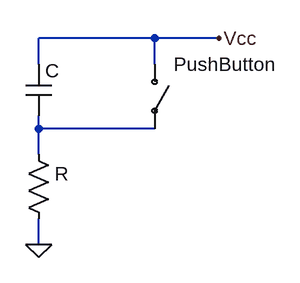
[diagram p0: schematic push_btn_debouncing.asc]
push_btn_debouncing.asc, the LTspice schematic file:
Version 4
SHEET 1 880 680
WIRE 176 48 32 48
WIRE 256 48 176 48
WIRE 32 80 32 48
WIRE 176 80 176 48
WIRE 32 160 32 144
WIRE 176 160 32 160
WIRE 32 192 32 160
WIRE 32 304 32 272
FLAG 32 304 0
FLAG 256 48 Vcc
SYMBOL cap 16 80 R0
SYMATTR InstName C
SYMATTR Value ""
SYMBOL res 16 176 R0
SYMATTR InstName R
SYMATTR Value ""
SYMBOL csw 176 80 R0
SYMATTR InstName PushButton
SYMATTR Value ""

The netlist it stands for:
* push_btn_debouncing.asc
C Vcc N001
R N001 0
W§PushButton Vcc N001
.backanno
.end